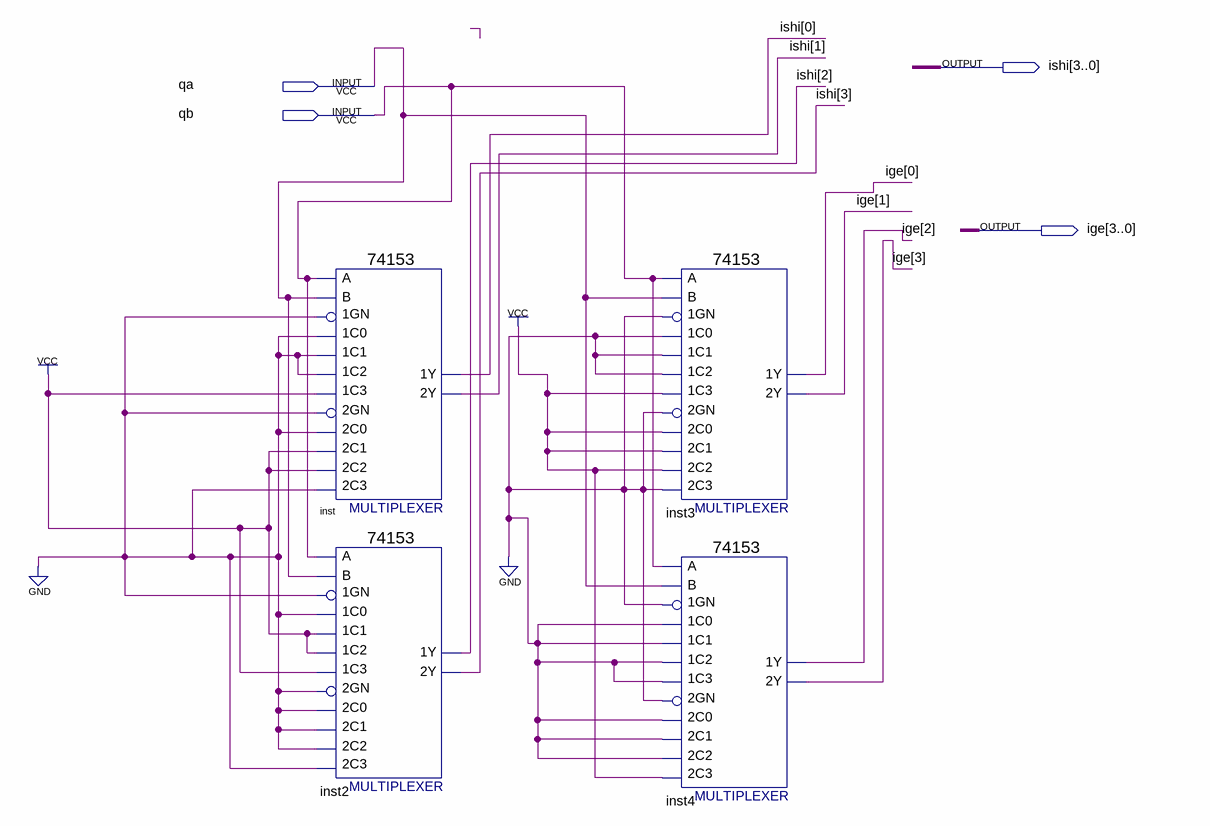
[diagram p0: schematic sheet]
// Quartus schematic xuanze.bdf as structural Verilog: 4 symbols, 4 pins
module xuanze (
  input  qa,
  input  qb,
  output [3:0] ishi,
  output [3:0] ige
);

  \74153  inst (
    .\1C1 (1'b0), .\1GN (1'b0), .\1C0 (1'b0), .\2C0 (1'b0), .\2GN (1'b0), .\2C2 (1'b1), .\1C2 (1'b0),
    .\1C3 (1'b1), .B(qa), .A(qb), .\2C1 (1'b1), .\2C3 (1'b0), .\1Y (ishi[0]), .\2Y (ishi[1]));
  \74153  inst2 (
    .\1C1 (1'b1), .\1GN (1'b0), .\1C0 (1'b0), .\2C0 (1'b0), .\2GN (1'b0), .\2C2 (1'b0), .\1C2 (1'b1),
    .\1C3 (1'b1), .B(qa), .A(qb), .\2C1 (1'b0), .\2C3 (1'b0), .\1Y (ishi[2]), .\2Y (ishi[3]));
  \74153  inst3 (
    .\1C1 (1'b0), .\1GN (1'b0), .\1C0 (1'b0), .\2C0 (1'b1), .\2GN (1'b0), .\2C2 (1'b1), .\1C2 (1'b0),
    .\1C3 (1'b1), .B(qa), .A(qb), .\2C1 (1'b1), .\2C3 (1'b0), .\1Y (ige[0]), .\2Y (ige[1]));
  \74153  inst4 (
    .\1C1 (1'b0), .\1GN (1'b0), .\1C0 (1'b0), .\2C0 (1'b0), .\2GN (1'b0), .\2C2 (1'b0), .\1C2 (1'b0),
    .\1C3 (1'b0), .B(qa), .A(qb), .\2C1 (1'b0), .\2C3 (1'b1), .\1Y (ige[2]), .\2Y (ige[3]));
endmodule
